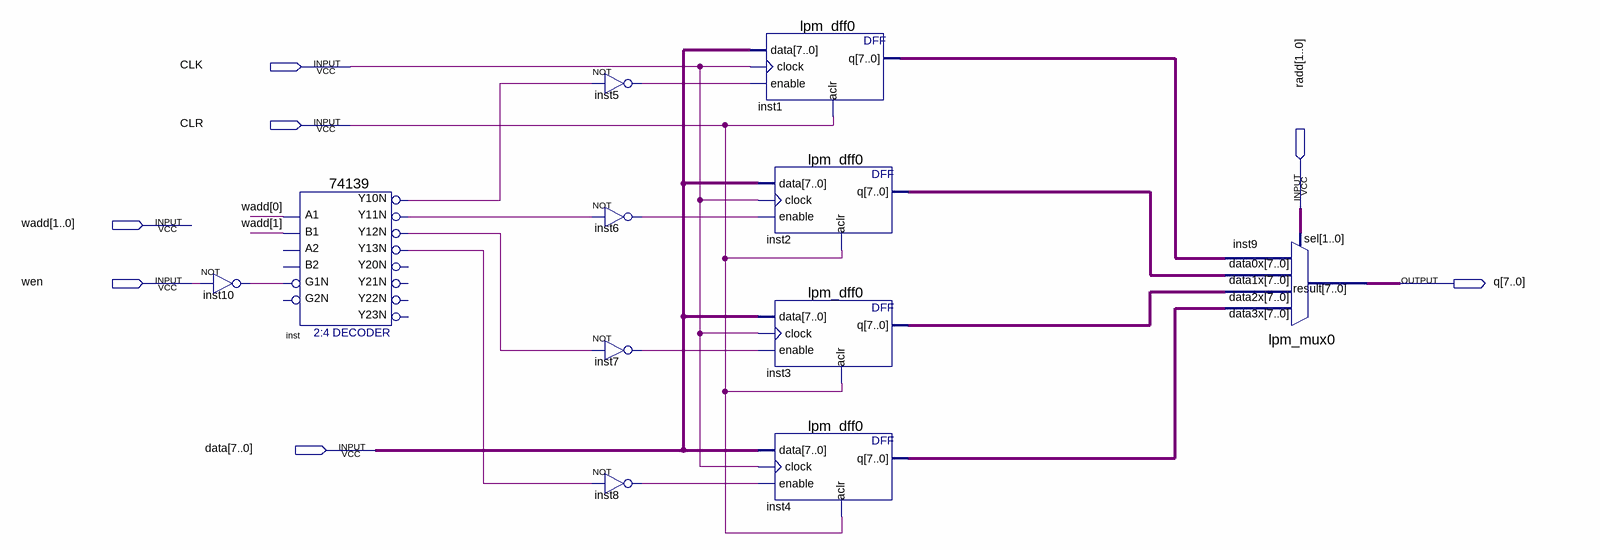
[diagram p0: schematic sheet]
// Quartus schematic Register.bdf as structural Verilog: 11 symbols, 7 pins
module Register (
  input  CLK,
  input  CLR,
  input  [1:0] radd,
  input  [1:0] wadd,
  input  wen,
  input  [7:0] data,
  output [7:0] q
);

  wire inst5_out, inst6_out, inst7_out, inst8_out, inst10_out, inst_y10n, inst_y11n, inst_y12n, inst_y13n;
  wire [7:0] inst1_q, inst2_q, inst3_q, inst4_q;

  not inst10 (inst10_out, wen);
  \74139  inst (
    .A1(wadd[0]), .B1(wadd[1]), .G1N(inst10_out), .Y10N(inst_y10n), .Y13N(inst_y13n), .Y12N(inst_y12n),
    .Y11N(inst_y11n));  // open: A2, B2, G2N, Y20N, Y21N, Y22N, Y23N
  not inst5 (inst5_out, inst_y10n);
  not inst6 (inst6_out, inst_y11n);
  not inst7 (inst7_out, inst_y12n);
  not inst8 (inst8_out, inst_y13n);
  lpm_dff0 inst1 (.data(data), .clock(CLK), .enable(inst5_out), .aclr(CLR), .q(inst1_q));
  lpm_dff0 inst2 (.data(data), .clock(CLK), .enable(inst6_out), .aclr(CLR), .q(inst2_q));
  lpm_dff0 inst3 (.data(data), .clock(CLK), .enable(inst7_out), .aclr(CLR), .q(inst3_q));
  lpm_dff0 inst4 (.data(data), .clock(CLK), .enable(inst8_out), .aclr(CLR), .q(inst4_q));
  lpm_mux0 inst9 (.data3x(inst4_q), .data2x(inst3_q), .data1x(inst2_q), .data0x(inst1_q), .sel(radd), .result(q));
endmodule
